# EAGLE design TV-B-Gone (EAGLE 6.4)
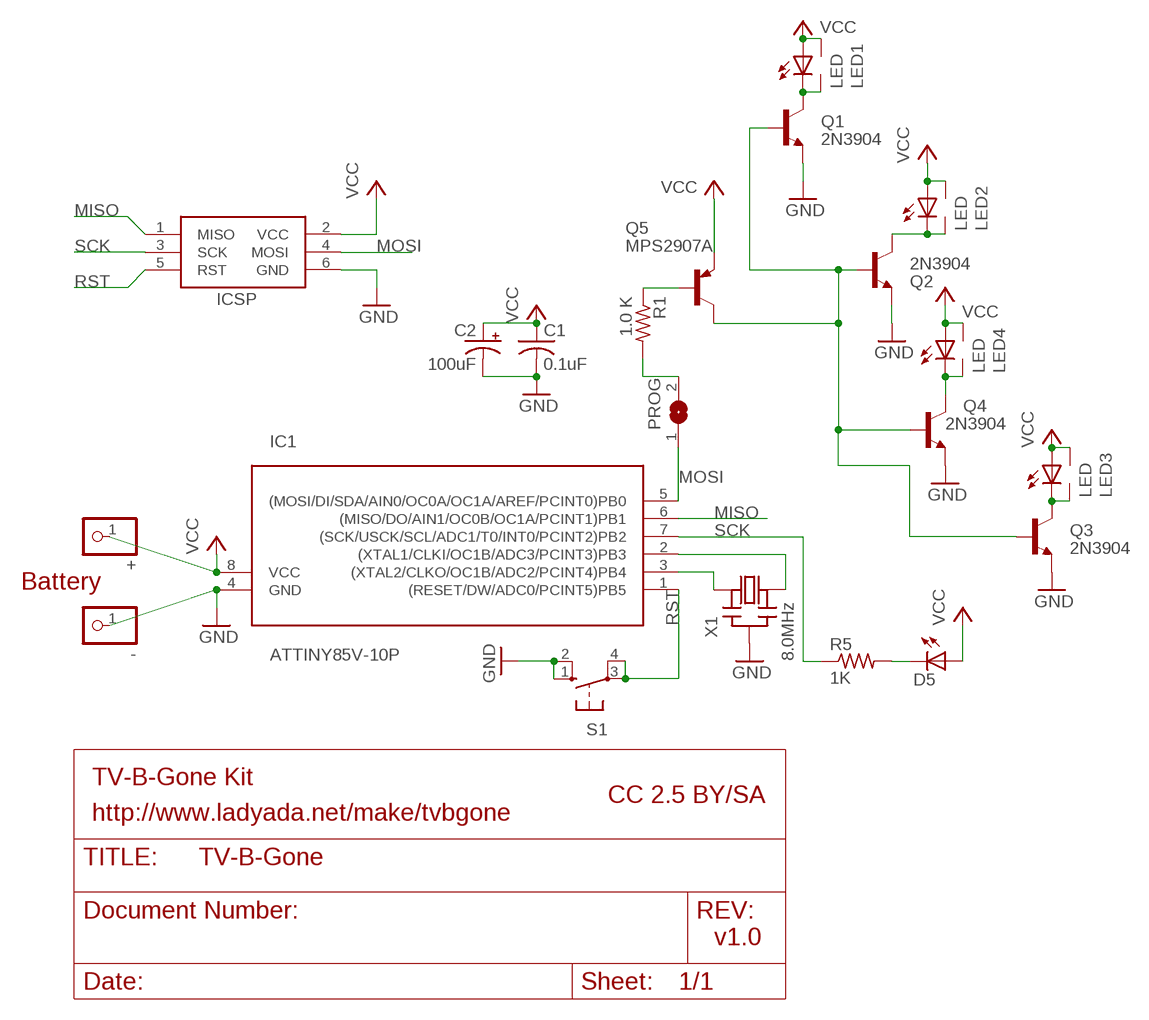
[diagram p0: schematic, sheet 1]

## Parts
+  PINHD-1X1CB  [1X01-CLEANBIG]
-  PINHD-1X1CB  [1X01-CLEANBIG]
C1  0.1uF  C-US025-025X050  [C025-025X050]
C2  100uF  CAP-POL_E-2.54-0511-HOR  [E-2.54-0511-HOR]
D5  LED3MM  [LED3MM]
IC1  ATTINY85V-10P  [DIL08]
ICSP  AVRISP-6  [AVRISP]
LED1  LED  [5MM-SIDE]
LED2  LED  [5MM-SIDE]
LED3  LED  [5MM-SIDE]
LED4  LED  [5MM-SIDE]
PROG  SJ  [SJ]
Q1  2N3904  2N3904-NPN-TO92-EBC  [TO92-EBC]
Q2  2N3904  2N3904-NPN-TO92-EBC  [TO92-EBC]
Q3  2N3904  2N3904-NPN-TO92-EBC  [TO92-EBC]
Q4  2N3904  2N3904-NPN-TO92-EBC  [TO92-EBC]
Q5  MPS2907A  [TO92-CBE]
R1  1.0 K  R-US_0207/10  [0207/10]
R5  1K  R-US_0207/10  [0207/10]
S1  10-XX  [B3F-10XX]
X1  8.0MHz  CERMOSCILL-THM  [CERM_OSC]

## Nets
GND: -.1 C1.2 C2.- IC1.4(GND) ICSP.6(GND) Q1.E Q2.E Q3.E Q4.E S1.1(S) S1.2(S1) X1.P$2(GND)
MISO: IC1.6((MISO/DO/AIN1/OC0B/OC1A/PCINT1)PB1) ICSP.1(MISO)
MOSI: IC1.5((MOSI/DI/SDA/AIN0/OC0A/OC1A/AREF/PCINT0)PB0) ICSP.4(MOSI) PROG.1
N$1: IC1.3((XTAL2/CLKO/OC1B/ADC2/PCINT4)PB4) X1.P$1(IN)
N$2: IC1.2((XTAL1/CLKI/OC1B/ADC3/PCINT3)PB3) X1.P$3(OUT)
N$3: D5.K(C) R5.2
N$6: Q5.B R1.1
N$7: LED4.K2(C1) LED4.K(C) Q4.C
N$8: LED2.K2(C1) LED2.K(C) Q2.C
N$9: LED3.K2(C1) LED3.K(C) Q3.C
N$10: Q1.B Q2.B Q3.B Q4.B Q5.C
N$11: LED1.K2(C1) LED1.K(C) Q1.C
N$12: PROG.2 R1.2
RST: IC1.1((RESET/DW/ADC0/PCINT5)PB5) ICSP.5(RST) S1.3(P) S1.4(P1)
SCK: IC1.7((SCK/USCK/SCL/ADC1/T0/INT0/PCINT2)PB2) ICSP.3(SCK) R5.1
VCC: +.1 C1.1 C2.+ D5.A IC1.8(VCC) ICSP.2(VCC) LED1.A LED1.A2(A1) LED2.A LED2.A2(A1) LED3.A LED3.A2(A1) LED4.A LED4.A2(A1) Q5.E

## Notes on the sheet
- Battery
- TV-B-Gone Kit
- CC 2.5 BY/SA
- http://www.ladyada.net/make/tvbgone
- v1.0

## Library data of the parts
+ - = IXR:PINHD-1X1: Pin header 1x1 for 0.1" spacing With round pins
C1 = rcl-ez:C-US: CAPACITOR, American symbol
C2 = IXR:CAP-POL: Polarized Capacitor
D5 = minimidi:LED: LED OSRAM: - CHIPLED LG R971, LG N971, LY N971, LG Q971, LY Q971, LO R971, LY R971 LH N974, LH R974 LS Q976, LO Q976, LY Q976 LO Q996 - Hyper CHIPLED LW Q18S LB Q993, LB Q99A, LB R99A - SideLED LS A670, LO A670, LY A670, LG A670, LP A670 LB A673, LV A673, LT A673, LW A673 LH A674 LY A675 LS A676, LA A676, LO A676, LY A676, LW A676 LS A679, LY A679, LG A679 - Hyper Micro SIDELED® LS Y876, LA Y876, LO Y876, LY Y876 LT Y87S - SmartLED LW L88C, LW L88S LB L89C, LB L89S, LG L890 LS L89K, LO L89K, LY L89K LS L896, LA L896, LO L896, LY L896 - TOPLED LS T670, LO T670, LY T670, LG T670, LP T670 LSG T670, LSP T670, LSY T670, LOP T670, LYG T670 LG T671, LOG T671, LSG T671 LB T673, LV T673, LT T673, LW T673 LH T674 LS T676, LA T676, LO T676, LY T676, LB T676, LH T676, LSB T676, LW T676 LB T67C, LV T67C, LT T67C, LS T67K, LO T67K, LY T67K, LW E67C LS E67B, LA E67B, LO E67B, LY E67B, LB E67C, LV E67C, LT E67C LW T67C LS T679, LY T679, LG T679 LS T770, LO T770, LY T770, LG T770, LP T770 LB T773, LV T773, LT T773, LW T773 LH T774 LS E675, LA E675, LY E675, LS T675 LS T776, LA T776, LO T776, LY T776, LB T776 LHGB T686 LT T68C, LB T68C - Hyper Mini TOPLED® LB M676 - Mini TOPLED Santana® LG M470 LS M47K, LO M47K, LY M47K Source: http://www.osram.convergy.de/
IC1 = avr:ATTINY85: MICROCONTROLLER 8 Kbytes FLASH 512 bytes EEPROM 512 bytes RAM 4-channel 10 bit ADC USI
ICSP = IXR:AVRISP: AVR ISP HEADER Standard 6 pin header for AVR programming
LED1-LED4 = tvbgone:LED
PROG = jumper:SJ: SMD solder JUMPER
Q1-Q4 = transistor-neu-to92:*-NPN-: NPN Transistror
Q5 = transistor-pnp:MPS2907*: PNP Transistror
R1 R5 = rcl-ez:R-US_: RESISTOR, American symbol
S1 = switch-omron:10-XX: OMRON SWITCH; MPN: B3F-1000; OC_FARNELL: 176432; OC_NEWARK: 36M3542
X1 = IXR:CERMOSCILL: Ceramic oscillator with built in capacitors such as ZTT-12MHz http://www.ladyada.net/library/eagle

## Board
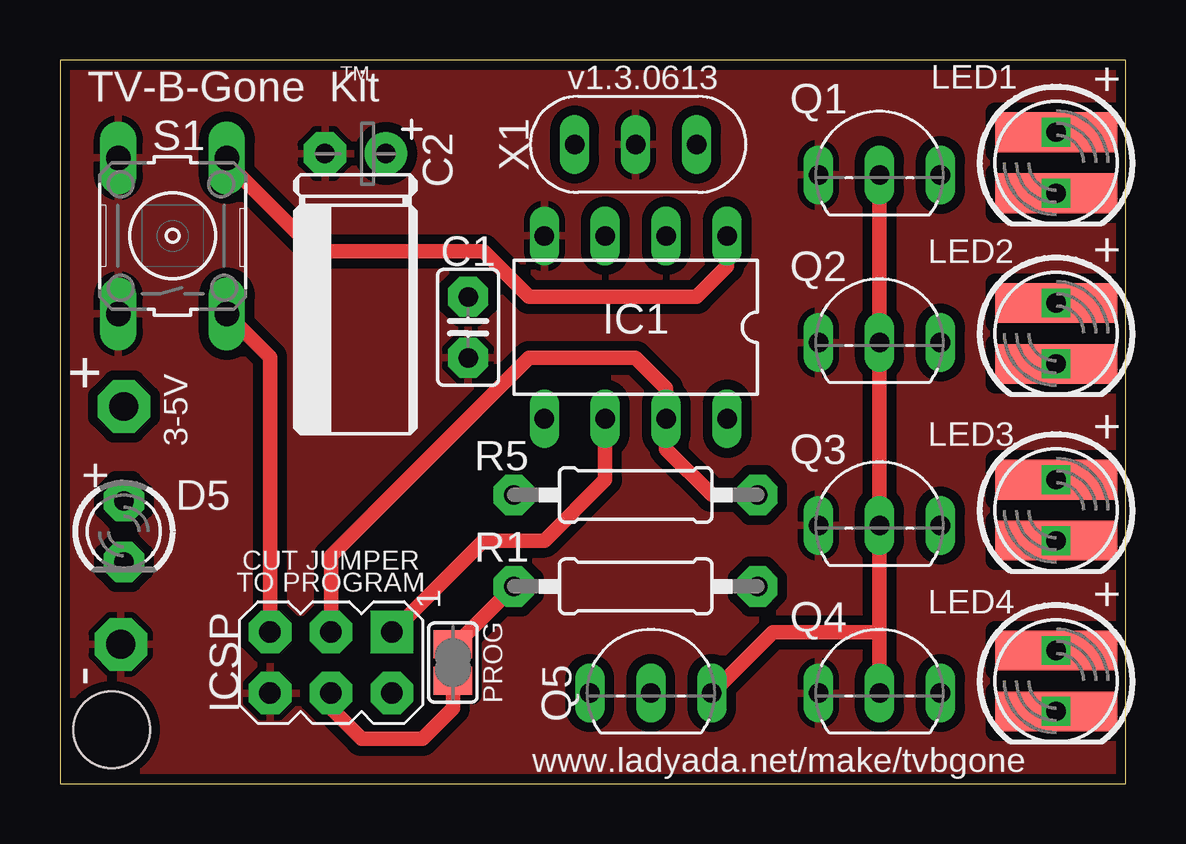
[diagram p1: board, top side]
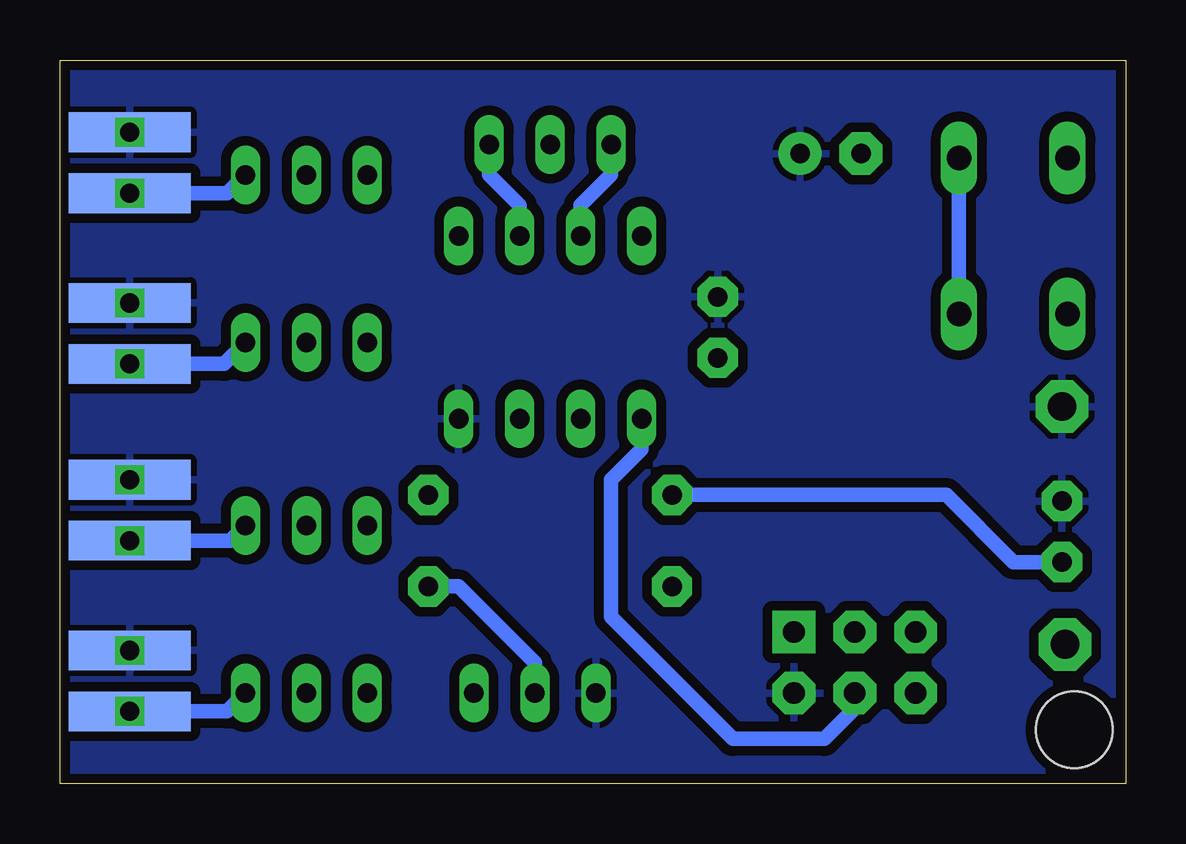
[diagram p2: board, bottom side, seen from below]

Size 44.43 x 30.15 mm. Coordinates in mm from the lower left corner, seen from the top.
Outline: 0,0 44.43,0 44.43,30.15 0,30.15 0,0
Copper layers (1*16): Top 0.0356mm / dielectric 1.5011mm / Bottom 0.0356mm
Design rules "LaenPCBOrder": minimum track width 6mil, minimum drill 13mil, track to track 6mil, track to pad 6mil, pad to pad 6mil, via to via 6mil, smd to smd 6mil, copper to edge 15mil, drill to drill 6mil, minimum pad ring 7mil, minimum via ring 7mil, stop-mask expansion 4mil, vias tented up to drill 0mil, thermal gap 10mil
Holes 3.2 mm at 2.15,2.25

### Footprints (pad centres in the part's own frame; a part is rotated, then mirrored left to right if it is on the bottom)
1X01-CLEANBIG = drill 1.2 pad 2.184 octagon: 1 0,0
C025-025X050 = drill 0.813 pad 1.676 octagon: 1 -1.27,0; 2 1.27,0
E-2.54-0511-HOR = drill 0.813 pad 1.778: + -1.27,0 | drill 0.813 pad 1.778 octagon: - 1.27,0
LED3MM = drill 0.813 pad 1.676 octagon: A -1.27,0; K 1.27,0
DIL08 = drill 0.813 long: 1 -3.81,-3.81; 2 -1.27,-3.81; 3 1.27,-3.81; 4 3.81,-3.81; 5 3.81,3.81; 6 1.27,3.81; 7 -1.27,3.81; 8 -3.81,3.81
AVRISP = drill 0.9 pad 1.778 square: 1 -1.27,2.54 | drill 0.9 pad 1.778 octagon: 2 1.27,2.54; 3 -1.27,0; 4 1.27,0; 5 -1.27,-2.54; 6 1.27,-2.54
5MM-SIDE = smd 1.651 x 5.08: A -1.27,0; K 1.27,0 | smd 1.651 x 5.08 bottom: A2 -1.27,0; K2 1.27,0
SJ = smd 1.168 x 1.6: 1 -0.762,0; 2 0.762,0
TO92-EBC = drill 0.813 long: B 0,-1.27; C 2.54,-1.27; E -2.54,-1.27
TO92-CBE = drill 0.813 long: B 0,0; C 2.54,0; E -2.54,0
0207/10 = drill 0.813 pad 1.676 octagon: 1 -5.08,0; 2 5.08,0
B3F-10XX = drill 1.016 long: 1 -3.251,2.261; 2 3.251,2.261; 3 -3.251,-2.261; 4 3.251,-2.261
CERM_OSC = drill 0.813 long: P$1 -2.54,0; P$2 0,0; P$3 2.54,0

### Placement (x,y rotation side)
+  2.66,15.71 0 top
-  2.53,5.8 0 top
C1  17.01,19.01 270 top
C2  12.31,26.25 180 top
D5  2.66,10.5 270 top
IC1  24,19.01 180 top
ICSP  11.3,5.04 270 top
LED1  41.52,25.87 270 top
LED2  41.52,18.76 270 top
LED3  41.52,11.39 270 top
LED4  41.52,4.28 270 top
PROG  16.38,5.04 90 top
Q1  34.16,26.63 0 top
Q2  34.16,19.65 0 top
Q3  34.16,12.03 0 top
Q4  34.16,5.04 0 top
Q5  24.63,3.77 0 top
R1  24,8.22 180 top
R5  24,12.03 180 top
S1  4.69,22.82 90 top
X1  24,26.63 0 top

### Tracks (layer width: path | path; a pad name or v marks a point on that pad's centre or on a via)
GND
  pour Top (isolate 0.406): -0.13,30.19 -0.13,-0.04 44.32,-0.04 44.32,30.19
MISO
  Top 0.61: ICSP.1 17.65,10.12 20.19,10.12 22.73,12.66 IC1.6
MOSI
  Top 0.61: ICSP.4 11.3,3.14 12.57,1.87 15.11,1.87 16.38,3.14 PROG.1
  Bottom 0.61: ICSP.4 11.3,3.14 12.57,1.87 16.38,1.87 21.46,6.95 21.46,12.66 20.19,13.93 IC1.5
N$1
  Bottom 0.61: X1.P$1 21.46,25.36 22.73,24.09 IC1.3
N$2
  Bottom 0.61: X1.P$3 26.54,25.36 25.27,24.09 IC1.2
N$3
  Bottom 0.61: R5.2 7.49,12.03 4.69,9.23 D5.K
N$5
  Top 0.406: 16.38,5.68 16.38,4.41
N$6
  Bottom 0.61: Q5.B 24.63,5.04 27.81,8.22 R1.1
N$7  (via drill 0.8)
  Bottom 0.61: Q4.C 37.46,3.01 LED4.K2
  other vias: 41.52,3.01
N$8  (via drill 0.8)
  Bottom 0.61: Q2.C 37.59,17.49 LED2.K2
  other vias: 41.52,17.49
N$9  (via drill 0.8)
  Bottom 0.61: Q3.C 37.33,10.12 LED3.K2
  other vias: 41.52,10.12
N$10
  Top 0.61: Q1.B Q2.B Q3.B 34.16,6.31 | 34.16,6.31 Q4.B | Q5.C 29.71,6.31 34.16,6.31
N$11  (via drill 0.8)
  Bottom 0.61: LED1.K2 37.46,24.6 Q1.C
  other vias: 41.52,24.6
N$12
  Top 0.406: PROG.2 16.5,5.8
  Top 0.61: 16.5,5.8 R1.2
RST
  Top 0.61: ICSP.5 8.76,17.77 S1.3 | S1.4 6.96,25.89 10.66,22.19 17.65,22.19 19.55,20.28 26.54,20.28 27.81,21.55 IC1.1
  Bottom 0.61: S1.4 S1.3
SCK
  Top 0.61: ICSP.3 11.3,9.49 19.55,17.74 24,17.74 25.27,16.47 IC1.7 25.27,13.93 27.17,12.03 R5.1
VCC  (via drill 0.8)
  other vias: 41.52,27.14 41.52,20.03 41.52,12.66 41.52,5.55
  pour Bottom (isolate 0.406): -0.13,30.19 -0.13,-0.04 44.32,-0.04 44.32,30.19

### Text on the board
tPlace: v1.3.0613 | TM | + | TV-B-Gone Kit | S1 | + | 3-5V | + | + | + | www.ladyada.net/make/tvbgone
tNames: CUT JUMPER / TO PROGRAM